# Altium schematic sheet Mounting.SchDoc: Title
size A4; Date: *******; ApprovedBy: *******; CheckedBy: None; Author: *******; CompanyName: *******; DrawnBy: Name; Engineer: *******; Organization: *******; Address1: *******; Address2: *******; Address3: *******; Address4: *******; DocumentNumber: 3; Revision: *******; SheetNumber: 3; SheetTotal: 3; CurrentTime: *******; CurrentDate: *******; Time: *******; DocumentFullPathAndName: *******; DocumentName: *******; ModifiedDate: *******; ImagePath: *******; ProjectName: *******; Application_BuildNumber: *******
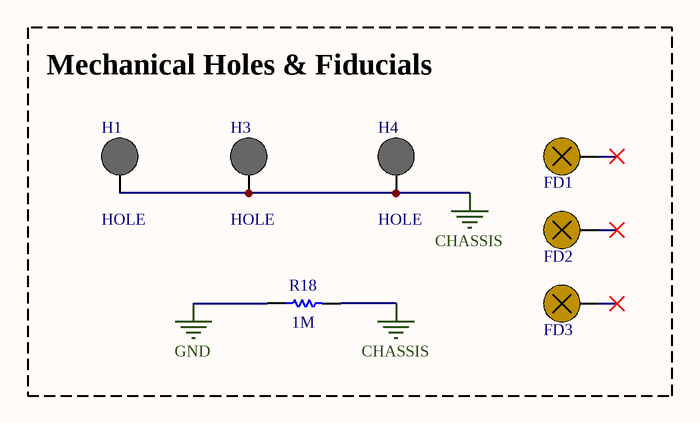
[diagram p0: Mounting.SchDoc]

## Parts
FD1  FIDUCIAL  [FIDUCIAL]  (value not drawn)  (no BOM)
FD2  FIDUCIAL  [FIDUCIAL]  (value not drawn)  (no BOM)
FD3  FIDUCIAL  [FIDUCIAL]  (value not drawn)  (no BOM)
H1  HOLE  [HOLE_M3]  (no BOM)
H3  HOLE  [HOLE_M3]  (no BOM)
H4  HOLE  [HOLE_M3]  (no BOM)
R18  value 1M  [0805]

## Blocks framed on the sheet
Mechanical Holes & Fiducials: FD1-FD3 H1 H3 H4 R18

## Nets
CHASSIS: H1.1 H3.1 H4.1 R18.2
GND: R18.1

Not connected (* = marked no-connect by the designer): FD1 1*; FD2 1*; FD3 1*

## Notes on the sheet
- Title:
- Size:
- Date:
- Drawn By:
- Page Contents:
- A4
- Checked By:
- Revision:
- Sheet
- of

## Library data of the parts
R18 = RES: Resistencia SMD 470ohms; Manufacturer: YAGEO; Manufacturer Part Number: RC0805FR-071ML; Supplier: JLCPCB; Supplier Part Number: C107700